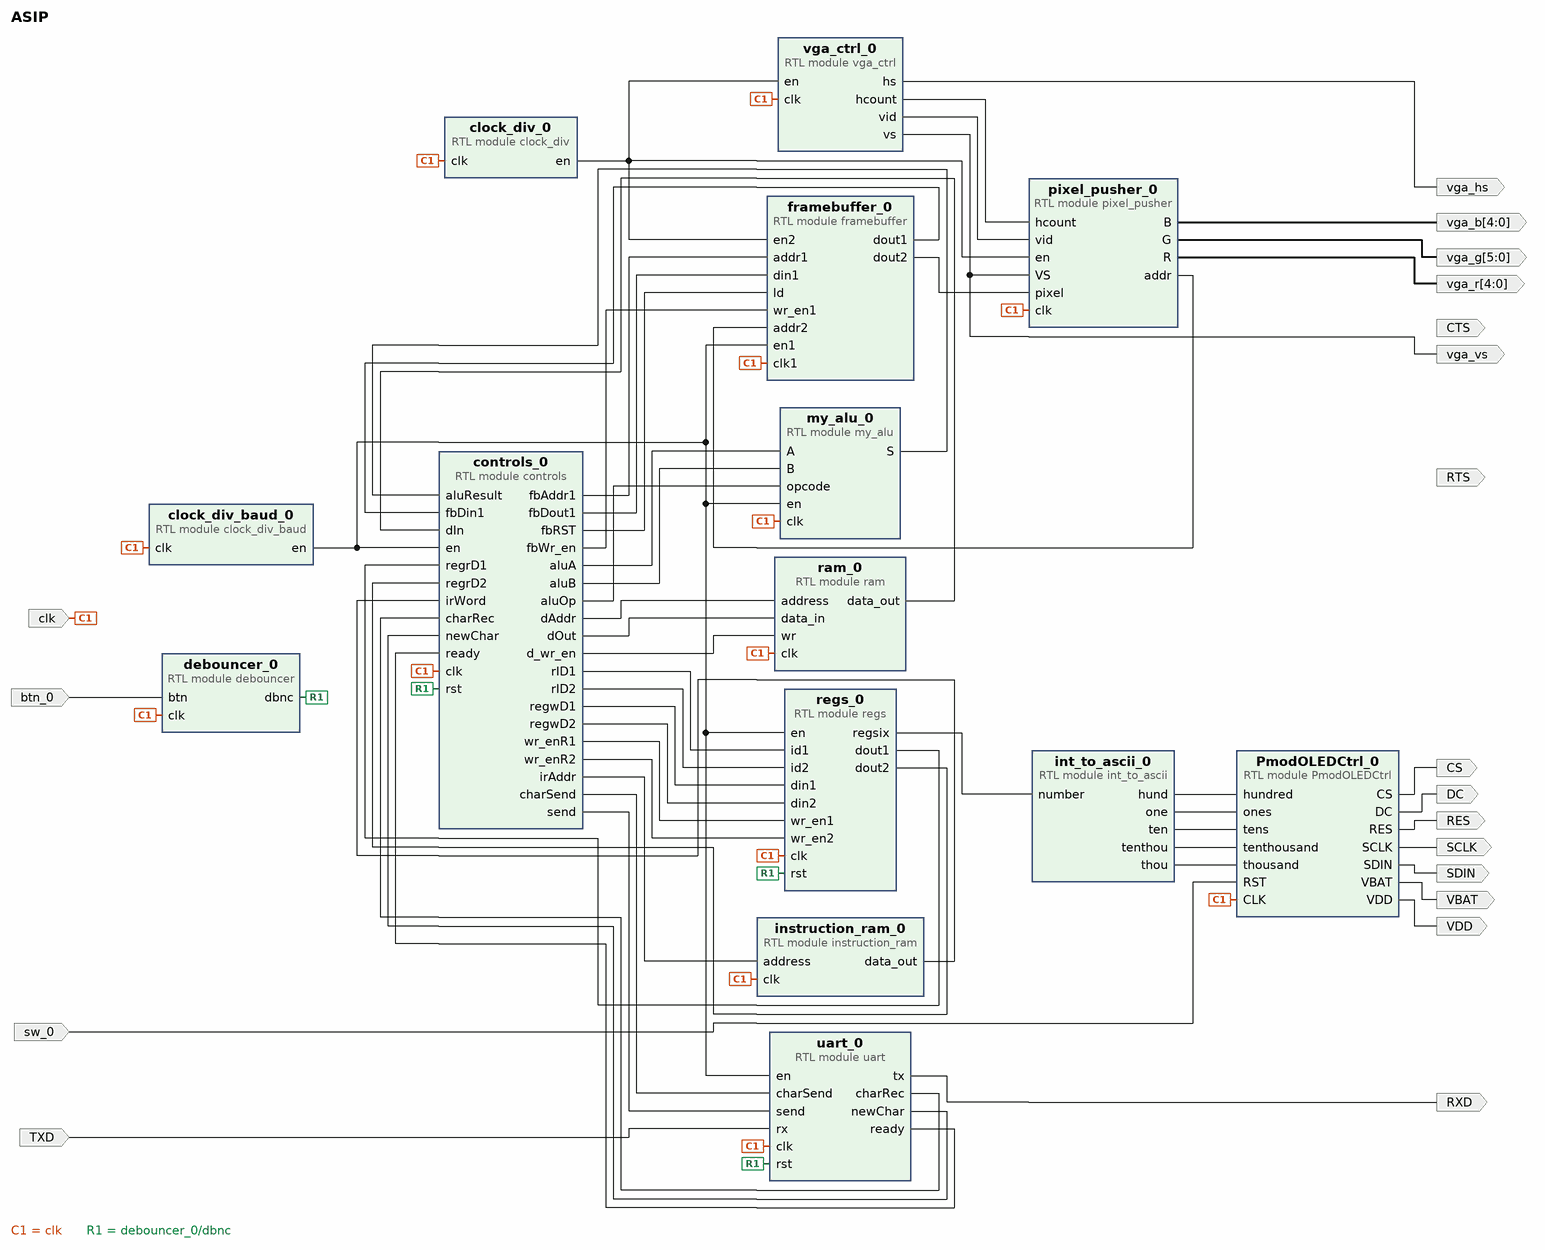
[diagram p0: block diagram of the top level]
# Vivado block design ASIP, xc7z010clg400-1, Vivado 2023.2
create_bd_design ASIP

create_bd_port -dir I -type clk clk
set_property -dict {CONFIG.FREQ_HZ 125000000} [get_bd_ports clk]
create_bd_port -dir I btn_0
create_bd_port -dir O vga_hs
create_bd_port -dir O vga_vs
create_bd_port -dir O -from 4 -to 0 vga_r
create_bd_port -dir O -from 4 -to 0 vga_b
create_bd_port -dir O -from 5 -to 0 vga_g
create_bd_port -dir I TXD
create_bd_port -dir O RXD
create_bd_port -dir O CS
create_bd_port -dir O SDIN
create_bd_port -dir O SCLK
create_bd_port -dir O DC
create_bd_port -dir O RES
create_bd_port -dir O VBAT
create_bd_port -dir O VDD
create_bd_port -dir I sw_0
create_bd_port -dir O CTS
create_bd_port -dir O RTS

create_bd_cell -type module -reference clock_div clock_div_0
create_bd_cell -type module -reference clock_div_baud clock_div_baud_0
create_bd_cell -type module -reference debouncer debouncer_0
create_bd_cell -type module -reference regs regs_0
create_bd_cell -type module -reference framebuffer framebuffer_0
create_bd_cell -type module -reference vga_ctrl vga_ctrl_0
create_bd_cell -type module -reference pixel_pusher pixel_pusher_0
create_bd_cell -type module -reference instruction_ram instruction_ram_0
create_bd_cell -type module -reference uart uart_0
create_bd_cell -type module -reference ram ram_0
create_bd_cell -type module -reference int_to_ascii int_to_ascii_0
create_bd_cell -type module -reference PmodOLEDCtrl PmodOLEDCtrl_0
create_bd_cell -type module -reference my_alu my_alu_0
create_bd_cell -type module -reference controls controls_0

# ---- connections ----

connect_bd_net [get_bd_pins PmodOLEDCtrl_0/CS] [get_bd_ports CS]
connect_bd_net [get_bd_pins PmodOLEDCtrl_0/DC] [get_bd_ports DC]
connect_bd_net [get_bd_pins PmodOLEDCtrl_0/RES] [get_bd_ports RES]
connect_bd_net [get_bd_pins PmodOLEDCtrl_0/SCLK] [get_bd_ports SCLK]
connect_bd_net [get_bd_pins PmodOLEDCtrl_0/SDIN] [get_bd_ports SDIN]
connect_bd_net [get_bd_pins PmodOLEDCtrl_0/VBAT] [get_bd_ports VBAT]
connect_bd_net [get_bd_pins PmodOLEDCtrl_0/VDD] [get_bd_ports VDD]
connect_bd_net -net btn_0_1 [get_bd_ports btn_0] [get_bd_pins debouncer_0/btn]
connect_bd_net -net clk_0_1 [get_bd_ports clk] \
  [get_bd_pins clock_div_baud_0/clk] [get_bd_pins clock_div_0/clk] [get_bd_pins debouncer_0/clk] [get_bd_pins regs_0/clk] \
  [get_bd_pins framebuffer_0/clk1] [get_bd_pins vga_ctrl_0/clk] [get_bd_pins pixel_pusher_0/clk] \
  [get_bd_pins instruction_ram_0/clk] [get_bd_pins ram_0/clk] [get_bd_pins my_alu_0/clk] [get_bd_pins controls_0/clk] \
  [get_bd_pins uart_0/clk] [get_bd_pins PmodOLEDCtrl_0/CLK]
connect_bd_net [get_bd_pins clock_div_0/en] [get_bd_pins framebuffer_0/en2] [get_bd_pins vga_ctrl_0/en] [get_bd_pins pixel_pusher_0/en]
connect_bd_net [get_bd_pins clock_div_baud_0/en] \
  [get_bd_pins regs_0/en] [get_bd_pins framebuffer_0/en1] [get_bd_pins my_alu_0/en] [get_bd_pins controls_0/en] \
  [get_bd_pins uart_0/en]
connect_bd_net [get_bd_pins controls_0/aluA] [get_bd_pins my_alu_0/A]
connect_bd_net [get_bd_pins controls_0/aluB] [get_bd_pins my_alu_0/B]
connect_bd_net [get_bd_pins controls_0/aluOp] [get_bd_pins my_alu_0/opcode]
connect_bd_net [get_bd_pins controls_0/charSend] [get_bd_pins uart_0/charSend]
connect_bd_net [get_bd_pins controls_0/dAddr] [get_bd_pins ram_0/address]
connect_bd_net [get_bd_pins controls_0/dOut] [get_bd_pins ram_0/data_in]
connect_bd_net [get_bd_pins controls_0/d_wr_en] [get_bd_pins ram_0/wr]
connect_bd_net [get_bd_pins controls_0/fbAddr1] [get_bd_pins framebuffer_0/addr1]
connect_bd_net [get_bd_pins controls_0/fbDout1] [get_bd_pins framebuffer_0/din1]
connect_bd_net [get_bd_pins controls_0/fbRST] [get_bd_pins framebuffer_0/ld]
connect_bd_net [get_bd_pins controls_0/fbWr_en] [get_bd_pins framebuffer_0/wr_en1]
connect_bd_net [get_bd_pins controls_0/irAddr] [get_bd_pins instruction_ram_0/address]
connect_bd_net [get_bd_pins controls_0/rID1] [get_bd_pins regs_0/id1]
connect_bd_net [get_bd_pins controls_0/rID2] [get_bd_pins regs_0/id2]
connect_bd_net [get_bd_pins controls_0/regwD1] [get_bd_pins regs_0/din1]
connect_bd_net [get_bd_pins controls_0/regwD2] [get_bd_pins regs_0/din2]
connect_bd_net [get_bd_pins controls_0/send] [get_bd_pins uart_0/send]
connect_bd_net [get_bd_pins controls_0/wr_enR1] [get_bd_pins regs_0/wr_en1]
connect_bd_net [get_bd_pins controls_0/wr_enR2] [get_bd_pins regs_0/wr_en2]
connect_bd_net [get_bd_pins debouncer_0/dbnc] [get_bd_pins regs_0/rst] [get_bd_pins controls_0/rst] [get_bd_pins uart_0/rst]
connect_bd_net [get_bd_pins framebuffer_0/dout1] [get_bd_pins controls_0/fbDin1]
connect_bd_net [get_bd_pins framebuffer_0/dout2] [get_bd_pins pixel_pusher_0/pixel]
connect_bd_net [get_bd_pins instruction_ram_0/data_out] [get_bd_pins controls_0/irWord]
connect_bd_net [get_bd_pins int_to_ascii_0/hund] [get_bd_pins PmodOLEDCtrl_0/hundred]
connect_bd_net [get_bd_pins int_to_ascii_0/one] [get_bd_pins PmodOLEDCtrl_0/ones]
connect_bd_net [get_bd_pins int_to_ascii_0/ten] [get_bd_pins PmodOLEDCtrl_0/tens]
connect_bd_net [get_bd_pins int_to_ascii_0/tenthou] [get_bd_pins PmodOLEDCtrl_0/tenthousand]
connect_bd_net [get_bd_pins int_to_ascii_0/thou] [get_bd_pins PmodOLEDCtrl_0/thousand]
connect_bd_net [get_bd_pins my_alu_0/S] [get_bd_pins controls_0/aluResult]
connect_bd_net [get_bd_pins pixel_pusher_0/B] [get_bd_ports vga_b]
connect_bd_net [get_bd_pins pixel_pusher_0/G] [get_bd_ports vga_g]
connect_bd_net [get_bd_pins pixel_pusher_0/R] [get_bd_ports vga_r]
connect_bd_net [get_bd_pins pixel_pusher_0/addr] [get_bd_pins framebuffer_0/addr2]
connect_bd_net [get_bd_pins ram_0/data_out] [get_bd_pins controls_0/dIn]
connect_bd_net [get_bd_pins regs_0/dout1] [get_bd_pins controls_0/regrD1]
connect_bd_net [get_bd_pins regs_0/dout2] [get_bd_pins controls_0/regrD2]
connect_bd_net [get_bd_pins regs_0/regsix] [get_bd_pins int_to_ascii_0/number]
connect_bd_net -net rx_0_1 [get_bd_ports TXD] [get_bd_pins uart_0/rx]
connect_bd_net -net sw_0_1 [get_bd_ports sw_0] [get_bd_pins PmodOLEDCtrl_0/RST]
connect_bd_net [get_bd_pins uart_0/charRec] [get_bd_pins controls_0/charRec]
connect_bd_net [get_bd_pins uart_0/newChar] [get_bd_pins controls_0/newChar]
connect_bd_net [get_bd_pins uart_0/ready] [get_bd_pins controls_0/ready]
connect_bd_net [get_bd_pins uart_0/tx] [get_bd_ports RXD]
connect_bd_net [get_bd_pins vga_ctrl_0/hcount] [get_bd_pins pixel_pusher_0/hcount]
connect_bd_net [get_bd_pins vga_ctrl_0/hs] [get_bd_ports vga_hs]
connect_bd_net [get_bd_pins vga_ctrl_0/vid] [get_bd_pins pixel_pusher_0/vid]
connect_bd_net [get_bd_pins vga_ctrl_0/vs] [get_bd_pins pixel_pusher_0/VS] [get_bd_ports vga_vs]

validate_bd_design
save_bd_design
